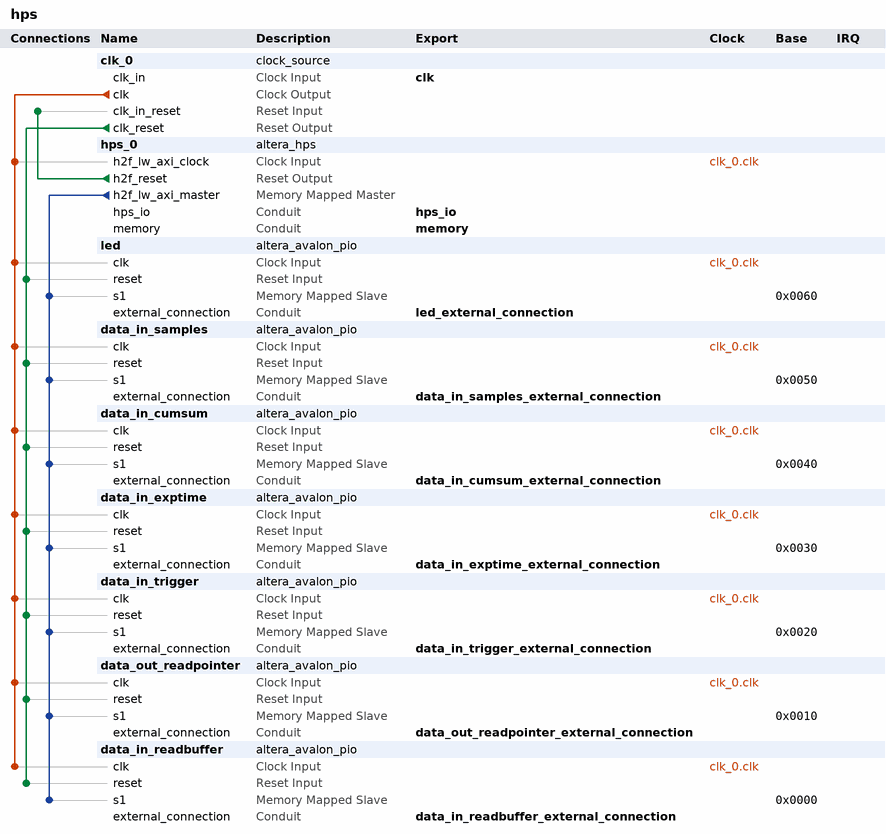
[diagram p0: system contents]
# Platform Designer (Qsys) system hps, Cyclone V 5CSXFC6D6F31C6
# Parameters at their usual value, and those the tool derives, are not listed.
package require -exact qsys 22.1
create_system hps
set_project_property DEVICE_FAMILY {Cyclone V}
set_project_property DEVICE 5CSXFC6D6F31C6

add_instance clk_0 clock_source 22.1
set_instance_parameter_value clk_0 clockFrequency 50000000

add_instance hps_0 altera_hps 22.1
set_instance_parameter_value hps_0 EMAC1_Mode RGMII
set_instance_parameter_value hps_0 EMAC1_PinMuxing {HPS I/O Set 0}
set_instance_parameter_value hps_0 F2SCLK_COLDRST_Enable false
set_instance_parameter_value hps_0 F2SCLK_DBGRST_Enable false
set_instance_parameter_value hps_0 F2SCLK_WARMRST_Enable false
set_instance_parameter_value hps_0 F2SINTERRUPT_Enable false
set_instance_parameter_value hps_0 F2S_Width 0
set_instance_parameter_value hps_0 FPGA_PERIPHERAL_OUTPUT_CLOCK_FREQ_EMAC0_GTX_CLK 125
set_instance_parameter_value hps_0 FPGA_PERIPHERAL_OUTPUT_CLOCK_FREQ_EMAC0_MD_CLK 2.5
set_instance_parameter_value hps_0 FPGA_PERIPHERAL_OUTPUT_CLOCK_FREQ_EMAC1_GTX_CLK 125
set_instance_parameter_value hps_0 FPGA_PERIPHERAL_OUTPUT_CLOCK_FREQ_EMAC1_MD_CLK 2.5
set_instance_parameter_value hps_0 HPS_PROTOCOL DDR3
set_instance_parameter_value hps_0 I2C0_Mode N/A
set_instance_parameter_value hps_0 I2C0_PinMuxing Unused
set_instance_parameter_value hps_0 I2C1_Mode N/A
set_instance_parameter_value hps_0 I2C1_PinMuxing Unused
set_instance_parameter_value hps_0 LWH2F_Enable true
set_instance_parameter_value hps_0 MEM_BANKADDR_WIDTH 3
set_instance_parameter_value hps_0 MEM_CLK_FREQ 400.0
set_instance_parameter_value hps_0 MEM_CLK_FREQ_MAX 400.0
set_instance_parameter_value hps_0 MEM_COL_ADDR_WIDTH 10
set_instance_parameter_value hps_0 MEM_DQ_WIDTH 32
set_instance_parameter_value hps_0 MEM_DRV_STR RZQ/6
set_instance_parameter_value hps_0 MEM_ROW_ADDR_WIDTH 15
set_instance_parameter_value hps_0 MEM_RTT_NOM RZQ/6
set_instance_parameter_value hps_0 MEM_RTT_WR {Dynamic ODT off}
set_instance_parameter_value hps_0 MEM_TCL 11
set_instance_parameter_value hps_0 MEM_TFAW_NS 45.0
set_instance_parameter_value hps_0 MEM_TRAS_NS 35.0
set_instance_parameter_value hps_0 MEM_TRCD_NS 13.75
set_instance_parameter_value hps_0 MEM_TRFC_NS 260.0
set_instance_parameter_value hps_0 MEM_TRP_NS 13.75
set_instance_parameter_value hps_0 MEM_VENDOR Micron
set_instance_parameter_value hps_0 MEM_WTCL 7
set_instance_parameter_value hps_0 QSPI_Mode N/A
set_instance_parameter_value hps_0 QSPI_PinMuxing Unused
set_instance_parameter_value hps_0 REF_CLK_FREQ 25.0
set_instance_parameter_value hps_0 S2FCLK_USER2CLK 5
set_instance_parameter_value hps_0 S2F_Width 0
set_instance_parameter_value hps_0 SDIO_Mode {4-bit Data}
set_instance_parameter_value hps_0 SDIO_PinMuxing {HPS I/O Set 0}
set_instance_parameter_value hps_0 SPIM1_Mode N/A
set_instance_parameter_value hps_0 SPIM1_PinMuxing Unused
set_instance_parameter_value hps_0 STM_Enable false
set_instance_parameter_value hps_0 TIMING_BOARD_AC_SKEW 0.02
set_instance_parameter_value hps_0 TIMING_BOARD_AC_TO_CK_SKEW 0.01
set_instance_parameter_value hps_0 TIMING_BOARD_DQ_TO_DQS_SKEW 0.05
set_instance_parameter_value hps_0 TIMING_BOARD_MAX_CK_DELAY 0.03
set_instance_parameter_value hps_0 TIMING_BOARD_MAX_DQS_DELAY 0.02
set_instance_parameter_value hps_0 TIMING_BOARD_SKEW_BETWEEN_DQS 0.06
set_instance_parameter_value hps_0 TIMING_BOARD_SKEW_CKDQS_DIMM_MAX 0.12
set_instance_parameter_value hps_0 TIMING_BOARD_SKEW_CKDQS_DIMM_MIN 0.06
set_instance_parameter_value hps_0 TIMING_BOARD_SKEW_WITHIN_DQS 0.01
set_instance_parameter_value hps_0 TIMING_TDH 65
set_instance_parameter_value hps_0 TIMING_TDQSCK 255
set_instance_parameter_value hps_0 TIMING_TDQSQ 125
set_instance_parameter_value hps_0 TIMING_TDS 30
set_instance_parameter_value hps_0 TIMING_TIH 140
set_instance_parameter_value hps_0 TIMING_TIS 190
set_instance_parameter_value hps_0 TIMING_TQSH 0.4
set_instance_parameter_value hps_0 UART0_Mode {No Flow Control}
set_instance_parameter_value hps_0 UART0_PinMuxing {HPS I/O Set 0}
set_instance_parameter_value hps_0 USB1_Mode SDR
set_instance_parameter_value hps_0 USB1_PinMuxing {HPS I/O Set 0}
set_instance_parameter_value hps_0 desired_cfg_clk_mhz 100.0
set_instance_parameter_value hps_0 desired_qspi_clk_mhz 400.0

add_instance led altera_avalon_pio 22.1
set_instance_parameter_value led direction Output
set_instance_parameter_value led width 8

add_instance data_in_samples altera_avalon_pio 22.1
set_instance_parameter_value data_in_samples direction Input
set_instance_parameter_value data_in_samples width 9

add_instance data_in_cumsum altera_avalon_pio 22.1
set_instance_parameter_value data_in_cumsum direction Input
set_instance_parameter_value data_in_cumsum width 28

add_instance data_in_exptime altera_avalon_pio 22.1
set_instance_parameter_value data_in_exptime direction Input
set_instance_parameter_value data_in_exptime width 32

add_instance data_in_trigger altera_avalon_pio 22.1
set_instance_parameter_value data_in_trigger direction Input
set_instance_parameter_value data_in_trigger width 1

add_instance data_out_readpointer altera_avalon_pio 22.1
set_instance_parameter_value data_out_readpointer direction Output
set_instance_parameter_value data_out_readpointer width 9

add_instance data_in_readbuffer altera_avalon_pio 22.1
set_instance_parameter_value data_in_readbuffer direction Input
set_instance_parameter_value data_in_readbuffer width 32

# connections
add_connection clk_0.clk data_in_cumsum.clk clock
add_connection clk_0.clk data_in_exptime.clk clock
add_connection clk_0.clk data_in_readbuffer.clk clock
add_connection clk_0.clk data_in_samples.clk clock
add_connection clk_0.clk data_in_trigger.clk clock
add_connection clk_0.clk data_out_readpointer.clk clock
add_connection clk_0.clk hps_0.h2f_lw_axi_clock clock
add_connection clk_0.clk led.clk clock
add_connection clk_0.clk_reset data_in_cumsum.reset reset
add_connection clk_0.clk_reset data_in_exptime.reset reset
add_connection clk_0.clk_reset data_in_readbuffer.reset reset
add_connection clk_0.clk_reset data_in_samples.reset reset
add_connection clk_0.clk_reset data_in_trigger.reset reset
add_connection clk_0.clk_reset data_out_readpointer.reset reset
add_connection clk_0.clk_reset led.reset reset
add_connection hps_0.h2f_reset clk_0.clk_in_reset reset
add_connection hps_0.h2f_lw_axi_master data_in_cumsum.s1 avalon
set_connection_parameter_value hps_0.h2f_lw_axi_master/data_in_cumsum.s1 baseAddress 0x0040
add_connection hps_0.h2f_lw_axi_master data_in_exptime.s1 avalon
set_connection_parameter_value hps_0.h2f_lw_axi_master/data_in_exptime.s1 baseAddress 0x0030
add_connection hps_0.h2f_lw_axi_master data_in_readbuffer.s1 avalon
set_connection_parameter_value hps_0.h2f_lw_axi_master/data_in_readbuffer.s1 baseAddress 0x0000
add_connection hps_0.h2f_lw_axi_master data_in_samples.s1 avalon
set_connection_parameter_value hps_0.h2f_lw_axi_master/data_in_samples.s1 baseAddress 0x0050
add_connection hps_0.h2f_lw_axi_master data_in_trigger.s1 avalon
set_connection_parameter_value hps_0.h2f_lw_axi_master/data_in_trigger.s1 baseAddress 0x0020
add_connection hps_0.h2f_lw_axi_master data_out_readpointer.s1 avalon
set_connection_parameter_value hps_0.h2f_lw_axi_master/data_out_readpointer.s1 baseAddress 0x0010
add_connection hps_0.h2f_lw_axi_master led.s1 avalon
set_connection_parameter_value hps_0.h2f_lw_axi_master/led.s1 baseAddress 0x0060

# exported interfaces
add_interface clk clock sink
set_interface_property clk EXPORT_OF clk_0.clk_in
add_interface data_in_cumsum_external_connection conduit end
set_interface_property data_in_cumsum_external_connection EXPORT_OF data_in_cumsum.external_connection
add_interface data_in_exptime_external_connection conduit end
set_interface_property data_in_exptime_external_connection EXPORT_OF data_in_exptime.external_connection
add_interface data_in_readbuffer_external_connection conduit end
set_interface_property data_in_readbuffer_external_connection EXPORT_OF data_in_readbuffer.external_connection
add_interface data_in_samples_external_connection conduit end
set_interface_property data_in_samples_external_connection EXPORT_OF data_in_samples.external_connection
add_interface data_in_trigger_external_connection conduit end
set_interface_property data_in_trigger_external_connection EXPORT_OF data_in_trigger.external_connection
add_interface data_out_readpointer_external_connection conduit end
set_interface_property data_out_readpointer_external_connection EXPORT_OF data_out_readpointer.external_connection
add_interface hps_io conduit end
set_interface_property hps_io EXPORT_OF hps_0.hps_io
add_interface led_external_connection conduit end
set_interface_property led_external_connection EXPORT_OF led.external_connection
add_interface memory conduit end
set_interface_property memory EXPORT_OF hps_0.memory

set_interconnect_requirement {$system} qsys_mm.clockCrossingAdapter HANDSHAKE
set_interconnect_requirement {$system} qsys_mm.enableEccProtection FALSE
set_interconnect_requirement {$system} qsys_mm.insertDefaultSlave FALSE
set_interconnect_requirement {$system} qsys_mm.maxAdditionalLatency 1

save_system hps.qsys
